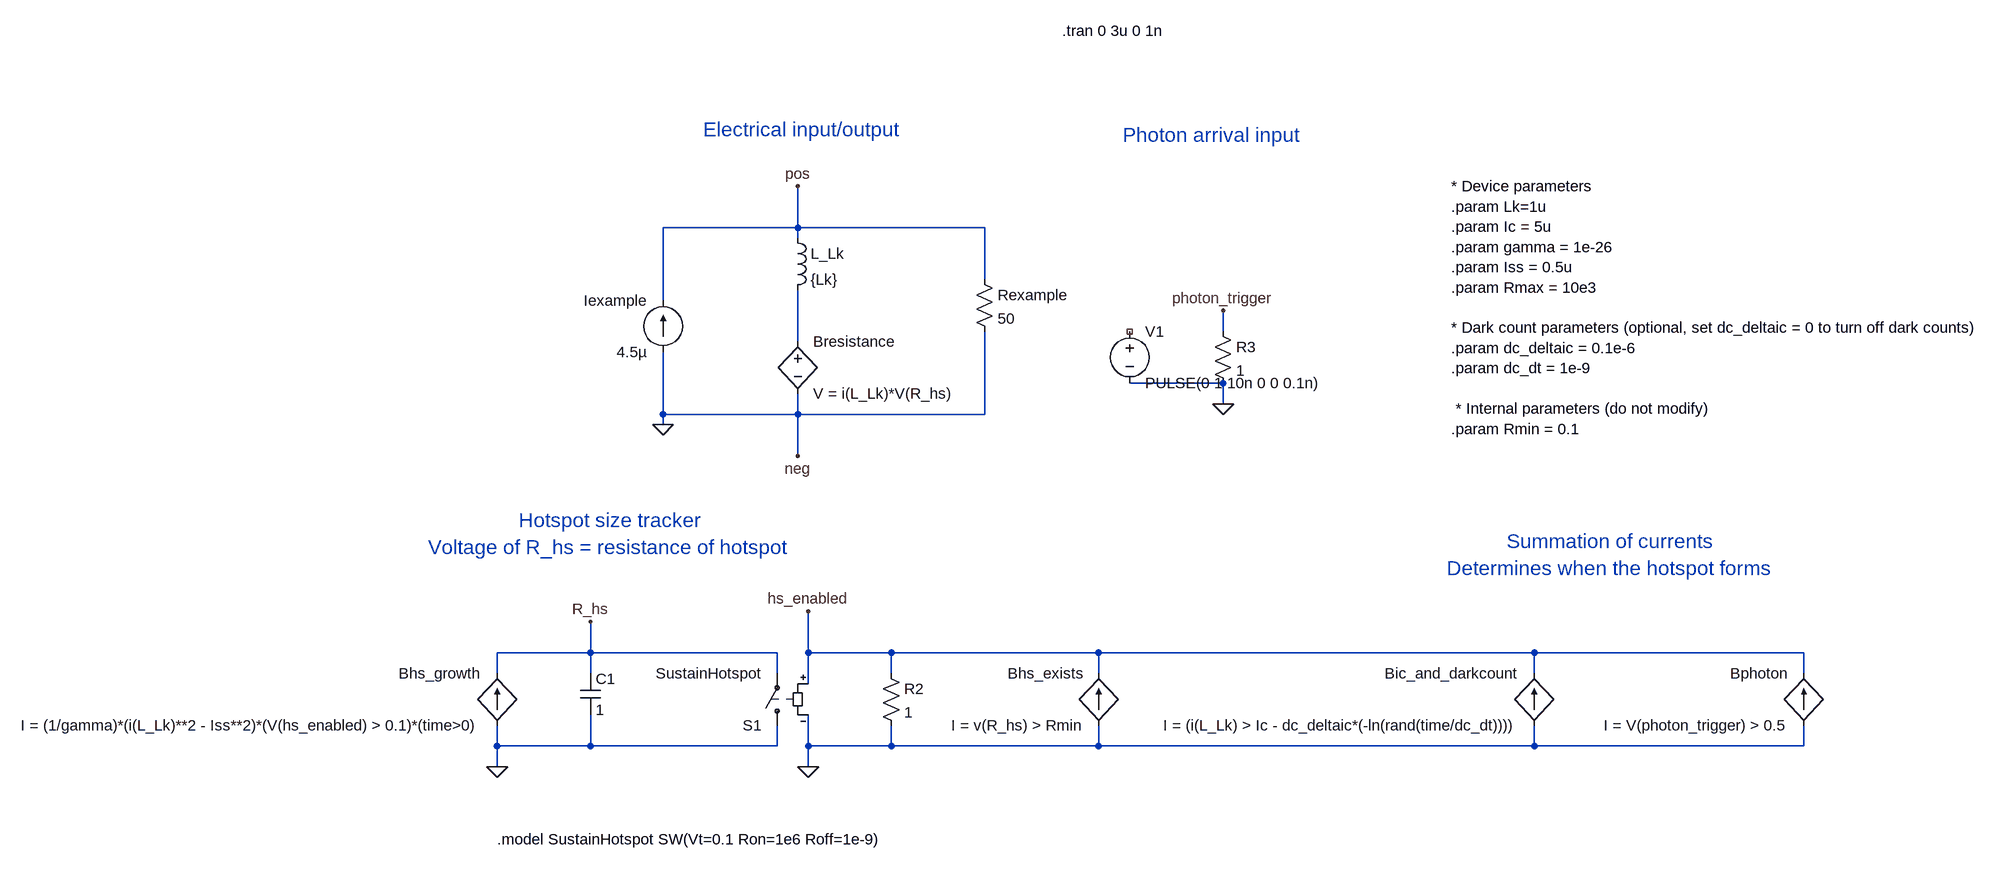
[diagram p0: schematic SNSPD-stochastic-gamma.asc]
SNSPD-stochastic-gamma.asc, the LTspice schematic file:
Version 4
SHEET 1 3792 1240
WIRE 64 -352 64 -416
WIRE 64 -352 -144 -352
WIRE 352 -352 64 -352
WIRE 64 -336 64 -352
WIRE 352 -272 352 -352
WIRE -144 -240 -144 -352
WIRE 720 -192 720 -224
WIRE 64 -176 64 -256
WIRE 720 -112 576 -112
WIRE 720 -80 720 -112
WIRE -144 -64 -144 -160
WIRE 64 -64 64 -96
WIRE 64 -64 -144 -64
WIRE 352 -64 352 -192
WIRE 352 -64 64 -64
WIRE -144 -48 -144 -64
WIRE 64 0 64 -64
WIRE -256 304 -256 256
WIRE -256 304 -400 304
WIRE 32 304 -256 304
WIRE 80 304 80 240
WIRE 208 304 80 304
WIRE 528 304 208 304
WIRE 1200 304 528 304
WIRE 1616 304 1200 304
WIRE -400 336 -400 304
WIRE -256 336 -256 304
WIRE 32 336 32 304
WIRE 208 336 208 304
WIRE 528 336 528 304
WIRE 1200 336 1200 304
WIRE 1616 336 1616 304
WIRE 80 352 80 304
WIRE -400 448 -400 416
WIRE -256 448 -256 400
WIRE -256 448 -400 448
WIRE 32 448 32 416
WIRE 32 448 -256 448
WIRE 80 448 80 400
WIRE 208 448 208 416
WIRE 208 448 80 448
WIRE 528 448 528 416
WIRE 528 448 208 448
WIRE 1200 448 1200 416
WIRE 1200 448 528 448
WIRE 1616 448 1616 416
WIRE 1616 448 1200 448
WIRE -400 480 -400 448
WIRE 80 480 80 448
FLAG 720 -224 photon_trigger
FLAG 64 -416 pos
FLAG 64 0 neg
FLAG -144 -48 0
FLAG -400 480 0
FLAG -256 256 R_hs
FLAG 80 480 0
FLAG 720 -80 0
FLAG 80 240 hs_enabled
SYMBOL ind 48 -352 R0
SYMATTR InstName L_Lk
SYMATTR Value {Lk}
SYMBOL res 336 -288 R0
SYMATTR InstName Rexample
SYMATTR Value 50
SYMBOL current -144 -160 R180
WINDOW 0 24 80 Left 2
WINDOW 3 24 0 Left 2
WINDOW 123 0 0 Left 2
WINDOW 39 0 0 Left 2
SYMATTR InstName Iexample
SYMATTR Value 4.5µ
SYMBOL bv 64 -192 R0
SYMATTR InstName Bresistance
SYMATTR Value V = i(L_Lk)*V(R_hs)
SYMBOL sw 32 432 R180
SYMATTR InstName S1
SYMATTR Value SustainHotspot
SYMBOL res 192 320 R0
SYMATTR InstName R2
SYMATTR Value 1
SYMBOL bi 528 416 R180
WINDOW 0 24 80 Left 2
WINDOW 3 24 0 Left 2
SYMATTR InstName Bhs_exists
SYMATTR Value I = v(R_hs) > Rmin
SYMBOL bi 1200 416 R180
WINDOW 0 24 80 Left 2
WINDOW 3 24 0 Left 2
SYMATTR InstName Bic_and_darkcount
SYMATTR Value I = (i(L_Lk) > Ic - dc_deltaic*(-ln(rand(time/dc_dt))))
SYMBOL bi -400 416 R180
WINDOW 0 24 80 Left 2
WINDOW 3 24 0 Left 2
SYMATTR InstName Bhs_growth
SYMATTR Value I = (1/gamma)*(i(L_Lk)**2 - Iss**2)*(V(hs_enabled) > 0.1)*(time>0)
SYMBOL bi 1616 416 R180
WINDOW 0 24 80 Left 2
WINDOW 3 24 0 Left 2
SYMATTR InstName Bphoton
SYMATTR Value I = V(photon_trigger) > 0.5
SYMBOL res 704 -208 R0
SYMATTR InstName R3
SYMATTR Value 1
SYMBOL cap -272 336 R0
SYMATTR InstName C1
SYMATTR Value 1
SYMBOL voltage 576 -208 R0
WINDOW 123 0 0 Left 0
WINDOW 39 0 0 Left 0
SYMATTR InstName V1
SYMATTR Value PULSE(0 1 10n 0 0 0.1n)
TEXT 1072 -416 Left 2 !* Device parameters\n.param Lk=1u\n.param Ic = 5u\n.param gamma = 1e-26\n.param Iss = 0.5u\n.param Rmax = 10e3\n \n* Dark count parameters (optional, set dc_deltaic = 0 to turn off dark counts)\n.param dc_deltaic = 0.1e-6\n.param dc_dt = 1e-9\n \n * Internal parameters (do not modify)\n.param Rmin = 0.1
TEXT -400 592 Left 2 !.model SustainHotspot SW(Vt=0.1 Ron=1e6 Roff=1e-9)
TEXT 72 -504 Center 3 ;Electrical input/output
TEXT 704 -496 Center 3 ;Photon arrival input
TEXT 1320 152 Center 3 ;Summation of currents\nDetermines when the hotspot forms
TEXT 472 -656 Left 2 !.tran 0 3u 0 1n
TEXT -224 120 Center 3 ;Hotspot size tracker\nVoltage of R_hs = resistance of hotspot

The netlist it stands for:
* SNSPD-stochastic-gamma.asc
L_Lk pos N001 {Lk}
Rexample pos 0 50
Iexample 0 pos 4.5µ
Bresistance N001 0 V = i(L_Lk)*V(R_hs)
S1 0 R_hs hs_enabled 0 SustainHotspot
R2 hs_enabled 0 1
Bhs_exists 0 hs_enabled I = v(R_hs) > Rmin
Bic_and_darkcount 0 hs_enabled I = (i(L_Lk) > Ic - dc_deltaic*(-ln(rand(time/dc_dt))))
Bhs_growth 0 R_hs I = (1/gamma)*(i(L_Lk)**2 - Iss**2)*(V(hs_enabled) > 0.1)*(time>0)
Bphoton 0 hs_enabled I = V(photon_trigger) > 0.5
R3 photon_trigger 0 1
C1 R_hs 0 1
V1 NC_01 0 PULSE(0 1 10n 0 0 0.1n)
* Device parameters
.param Lk=1u
.param Ic = 5u
.param gamma = 1e-26
.param Iss = 0.5u
.param Rmax = 10e3
* Dark count parameters (optional, set dc_deltaic = 0 to turn off dark counts)
.param dc_deltaic = 0.1e-6
.param dc_dt = 1e-9
 * Internal parameters (do not modify)
.param Rmin = 0.1
.model SustainHotspot SW(Vt=0.1 Ron=1e6 Roff=1e-9)
* Electrical input/output
* Photon arrival input
* Summation of currents
* Determines when the hotspot forms
.tran 0 3u 0 1n
* Hotspot size tracker
* Voltage of R_hs = resistance of hotspot
.backanno
.end